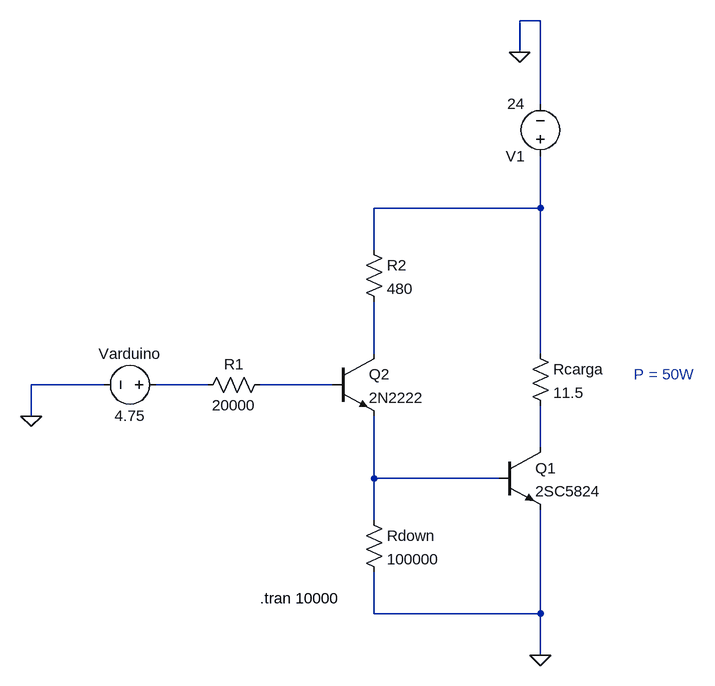
[diagram p0: schematic teste_sist_aquecimento.asc]
teste_sist_aquecimento.asc, the LTspice schematic file:
Version 4.1
SHEET 1 880 680
WIRE 272 -528 240 -528
WIRE 240 -480 240 -528
WIRE 272 -400 272 -528
WIRE 272 -240 272 -320
WIRE 272 -240 16 -240
WIRE 16 -176 16 -240
WIRE 16 -16 16 -96
WIRE 272 -16 272 -240
WIRE -400 32 -512 32
WIRE -240 32 -320 32
WIRE -48 32 -160 32
WIRE -512 80 -512 32
WIRE 272 128 272 64
WIRE 16 176 16 80
WIRE 208 176 16 176
WIRE 16 240 16 176
WIRE 16 384 16 320
WIRE 272 384 272 224
WIRE 272 384 16 384
WIRE 272 448 272 384
FLAG 272 448 0
FLAG 240 -480 0
FLAG -512 80 0
SYMBOL npn3 208 128 R0
SYMATTR InstName Q1
SYMATTR Value 2SC5824
SYMBOL res 256 -32 R0
SYMATTR InstName Rcarga
SYMATTR Value 11.5
SYMATTR SpiceLine pwr=50
SYMBOL voltage 272 -304 R180
WINDOW 123 0 0 Left 0
WINDOW 39 0 0 Left 0
SYMATTR InstName V1
SYMATTR Value 24
SYMBOL npn3 -48 -16 R0
SYMATTR InstName Q2
SYMATTR Value 2N2222
SYMBOL res 0 -192 R0
SYMATTR InstName R2
SYMATTR Value 480
SYMBOL res 0 224 R0
SYMATTR InstName Rdown
SYMATTR Value 100000
SYMBOL res -144 16 R90
WINDOW 0 0 56 VBottom 2
WINDOW 3 32 56 VTop 2
SYMATTR InstName R1
SYMATTR Value 20000
SYMBOL voltage -304 32 R90
WINDOW 0 -32 56 VBottom 2
WINDOW 3 32 56 VTop 2
WINDOW 123 0 0 Left 0
WINDOW 39 0 0 Left 0
SYMATTR InstName Varduino
SYMATTR Value 4.75
TEXT -160 360 Left 2 !.tran 10000
TEXT 416 16 Left 2 ;P = 50W

The netlist it stands for:
* teste_sist_aquecimento.asc
Q1 N005 N006 0 0 2SC5824
Rcarga N001 N005 11.5 pwr=50
V1 N001 0 24
Q2 N002 N004 N006 0 2N2222
R2 N001 N002 480
Rdown N006 0 100000
R1 N004 N003 20000
Varduino N003 0 4.75
.model NPN NPN
.model PNP PNP
.lib standard.bjt
.tran 10000
* P = 50W
.backanno
.end